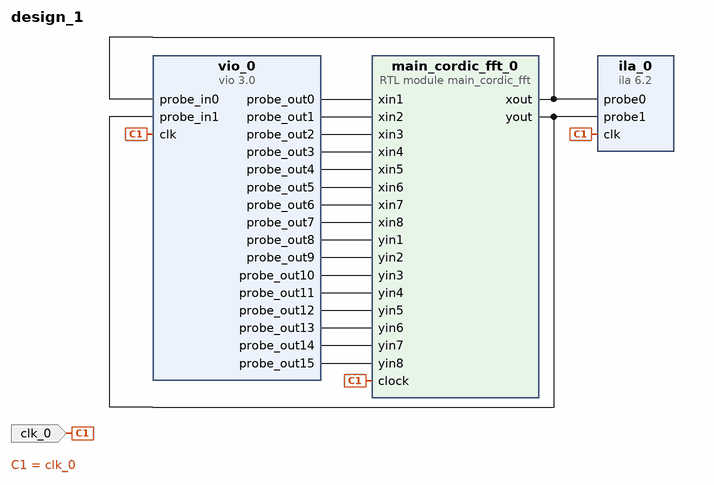
[diagram p0: block diagram of the top level]
# Vivado block design design_1, xc7a35tcpg236-1, Vivado 2022.2
create_bd_design design_1

create_bd_port -dir I -type clk clk_0

create_bd_cell -type ip -vlnv xilinx.com:ip:vio:3.0 vio_0
set_property -dict [list \
  CONFIG.C_NUM_PROBE_IN 2 \
  CONFIG.C_NUM_PROBE_OUT 16 \
  CONFIG.C_PROBE_OUT0_WIDTH 16 \
  CONFIG.C_PROBE_OUT10_WIDTH 16 \
  CONFIG.C_PROBE_OUT11_WIDTH 16 \
  CONFIG.C_PROBE_OUT12_WIDTH 16 \
  CONFIG.C_PROBE_OUT13_WIDTH 16 \
  CONFIG.C_PROBE_OUT14_WIDTH 16 \
  CONFIG.C_PROBE_OUT15_WIDTH 16 \
  CONFIG.C_PROBE_OUT1_WIDTH 16 \
  CONFIG.C_PROBE_OUT2_WIDTH 16 \
  CONFIG.C_PROBE_OUT3_WIDTH 16 \
  CONFIG.C_PROBE_OUT4_WIDTH 16 \
  CONFIG.C_PROBE_OUT5_WIDTH 16 \
  CONFIG.C_PROBE_OUT6_WIDTH 16 \
  CONFIG.C_PROBE_OUT7_WIDTH 16 \
  CONFIG.C_PROBE_OUT8_WIDTH 16 \
  CONFIG.C_PROBE_OUT9_WIDTH 16 \
] [get_bd_cells vio_0]
create_bd_cell -type module -reference main_cordic_fft main_cordic_fft_0
create_bd_cell -type ip -vlnv xilinx.com:ip:ila:6.2 ila_0
set_property -dict [list \
  CONFIG.C_MONITOR_TYPE Native \
  CONFIG.C_NUM_OF_PROBES 2 \
  CONFIG.C_PROBE0_WIDTH 129 \
  CONFIG.C_PROBE1_WIDTH 129 \
] [get_bd_cells ila_0]

# ---- connections ----

connect_bd_net -net clk_0_1 [get_bd_ports clk_0] [get_bd_pins vio_0/clk] [get_bd_pins main_cordic_fft_0/clock] [get_bd_pins ila_0/clk]
connect_bd_net [get_bd_pins main_cordic_fft_0/xout] [get_bd_pins vio_0/probe_in0] [get_bd_pins ila_0/probe0]
connect_bd_net [get_bd_pins main_cordic_fft_0/yout] [get_bd_pins vio_0/probe_in1] [get_bd_pins ila_0/probe1]
connect_bd_net [get_bd_pins vio_0/probe_out0] [get_bd_pins main_cordic_fft_0/xin1]
connect_bd_net [get_bd_pins vio_0/probe_out1] [get_bd_pins main_cordic_fft_0/xin2]
connect_bd_net [get_bd_pins vio_0/probe_out2] [get_bd_pins main_cordic_fft_0/xin3]
connect_bd_net [get_bd_pins vio_0/probe_out3] [get_bd_pins main_cordic_fft_0/xin4]
connect_bd_net [get_bd_pins vio_0/probe_out4] [get_bd_pins main_cordic_fft_0/xin5]
connect_bd_net [get_bd_pins vio_0/probe_out5] [get_bd_pins main_cordic_fft_0/xin6]
connect_bd_net [get_bd_pins vio_0/probe_out6] [get_bd_pins main_cordic_fft_0/xin7]
connect_bd_net [get_bd_pins vio_0/probe_out7] [get_bd_pins main_cordic_fft_0/xin8]
connect_bd_net [get_bd_pins vio_0/probe_out8] [get_bd_pins main_cordic_fft_0/yin1]
connect_bd_net [get_bd_pins vio_0/probe_out9] [get_bd_pins main_cordic_fft_0/yin2]
connect_bd_net [get_bd_pins vio_0/probe_out10] [get_bd_pins main_cordic_fft_0/yin3]
connect_bd_net [get_bd_pins vio_0/probe_out11] [get_bd_pins main_cordic_fft_0/yin4]
connect_bd_net [get_bd_pins vio_0/probe_out12] [get_bd_pins main_cordic_fft_0/yin5]
connect_bd_net [get_bd_pins vio_0/probe_out13] [get_bd_pins main_cordic_fft_0/yin6]
connect_bd_net [get_bd_pins vio_0/probe_out14] [get_bd_pins main_cordic_fft_0/yin7]
connect_bd_net [get_bd_pins vio_0/probe_out15] [get_bd_pins main_cordic_fft_0/yin8]

validate_bd_design
save_bd_design
